# Altium schematic sheet FPGA_Power.SchDoc: {Наименование}
size 420 x 297 mm; DocumentNumber: ПЛАС.ХХХХХХ.ХХХ ХХ; SheetNumber: 3; SheetTotal: 11; PageSetup: Record=PageOptions|CenterHorizontal=False|CenterVertical=False|PrintScale=0.95|XCorrection=0.00|YCorrection=0.00|PrintKind=1|BorderSize=5000000|LeftOffset=0|BottomOffset=0|Orientation=1|PaperLength=1000|PaperWidth=1000|Scale=100|PaperSource=15|PrintQuality=600|MediaType=1|DitherType=10|PaperKind=A4|PrintScaleMode=1; Rule: PcbType=ProtelPcb
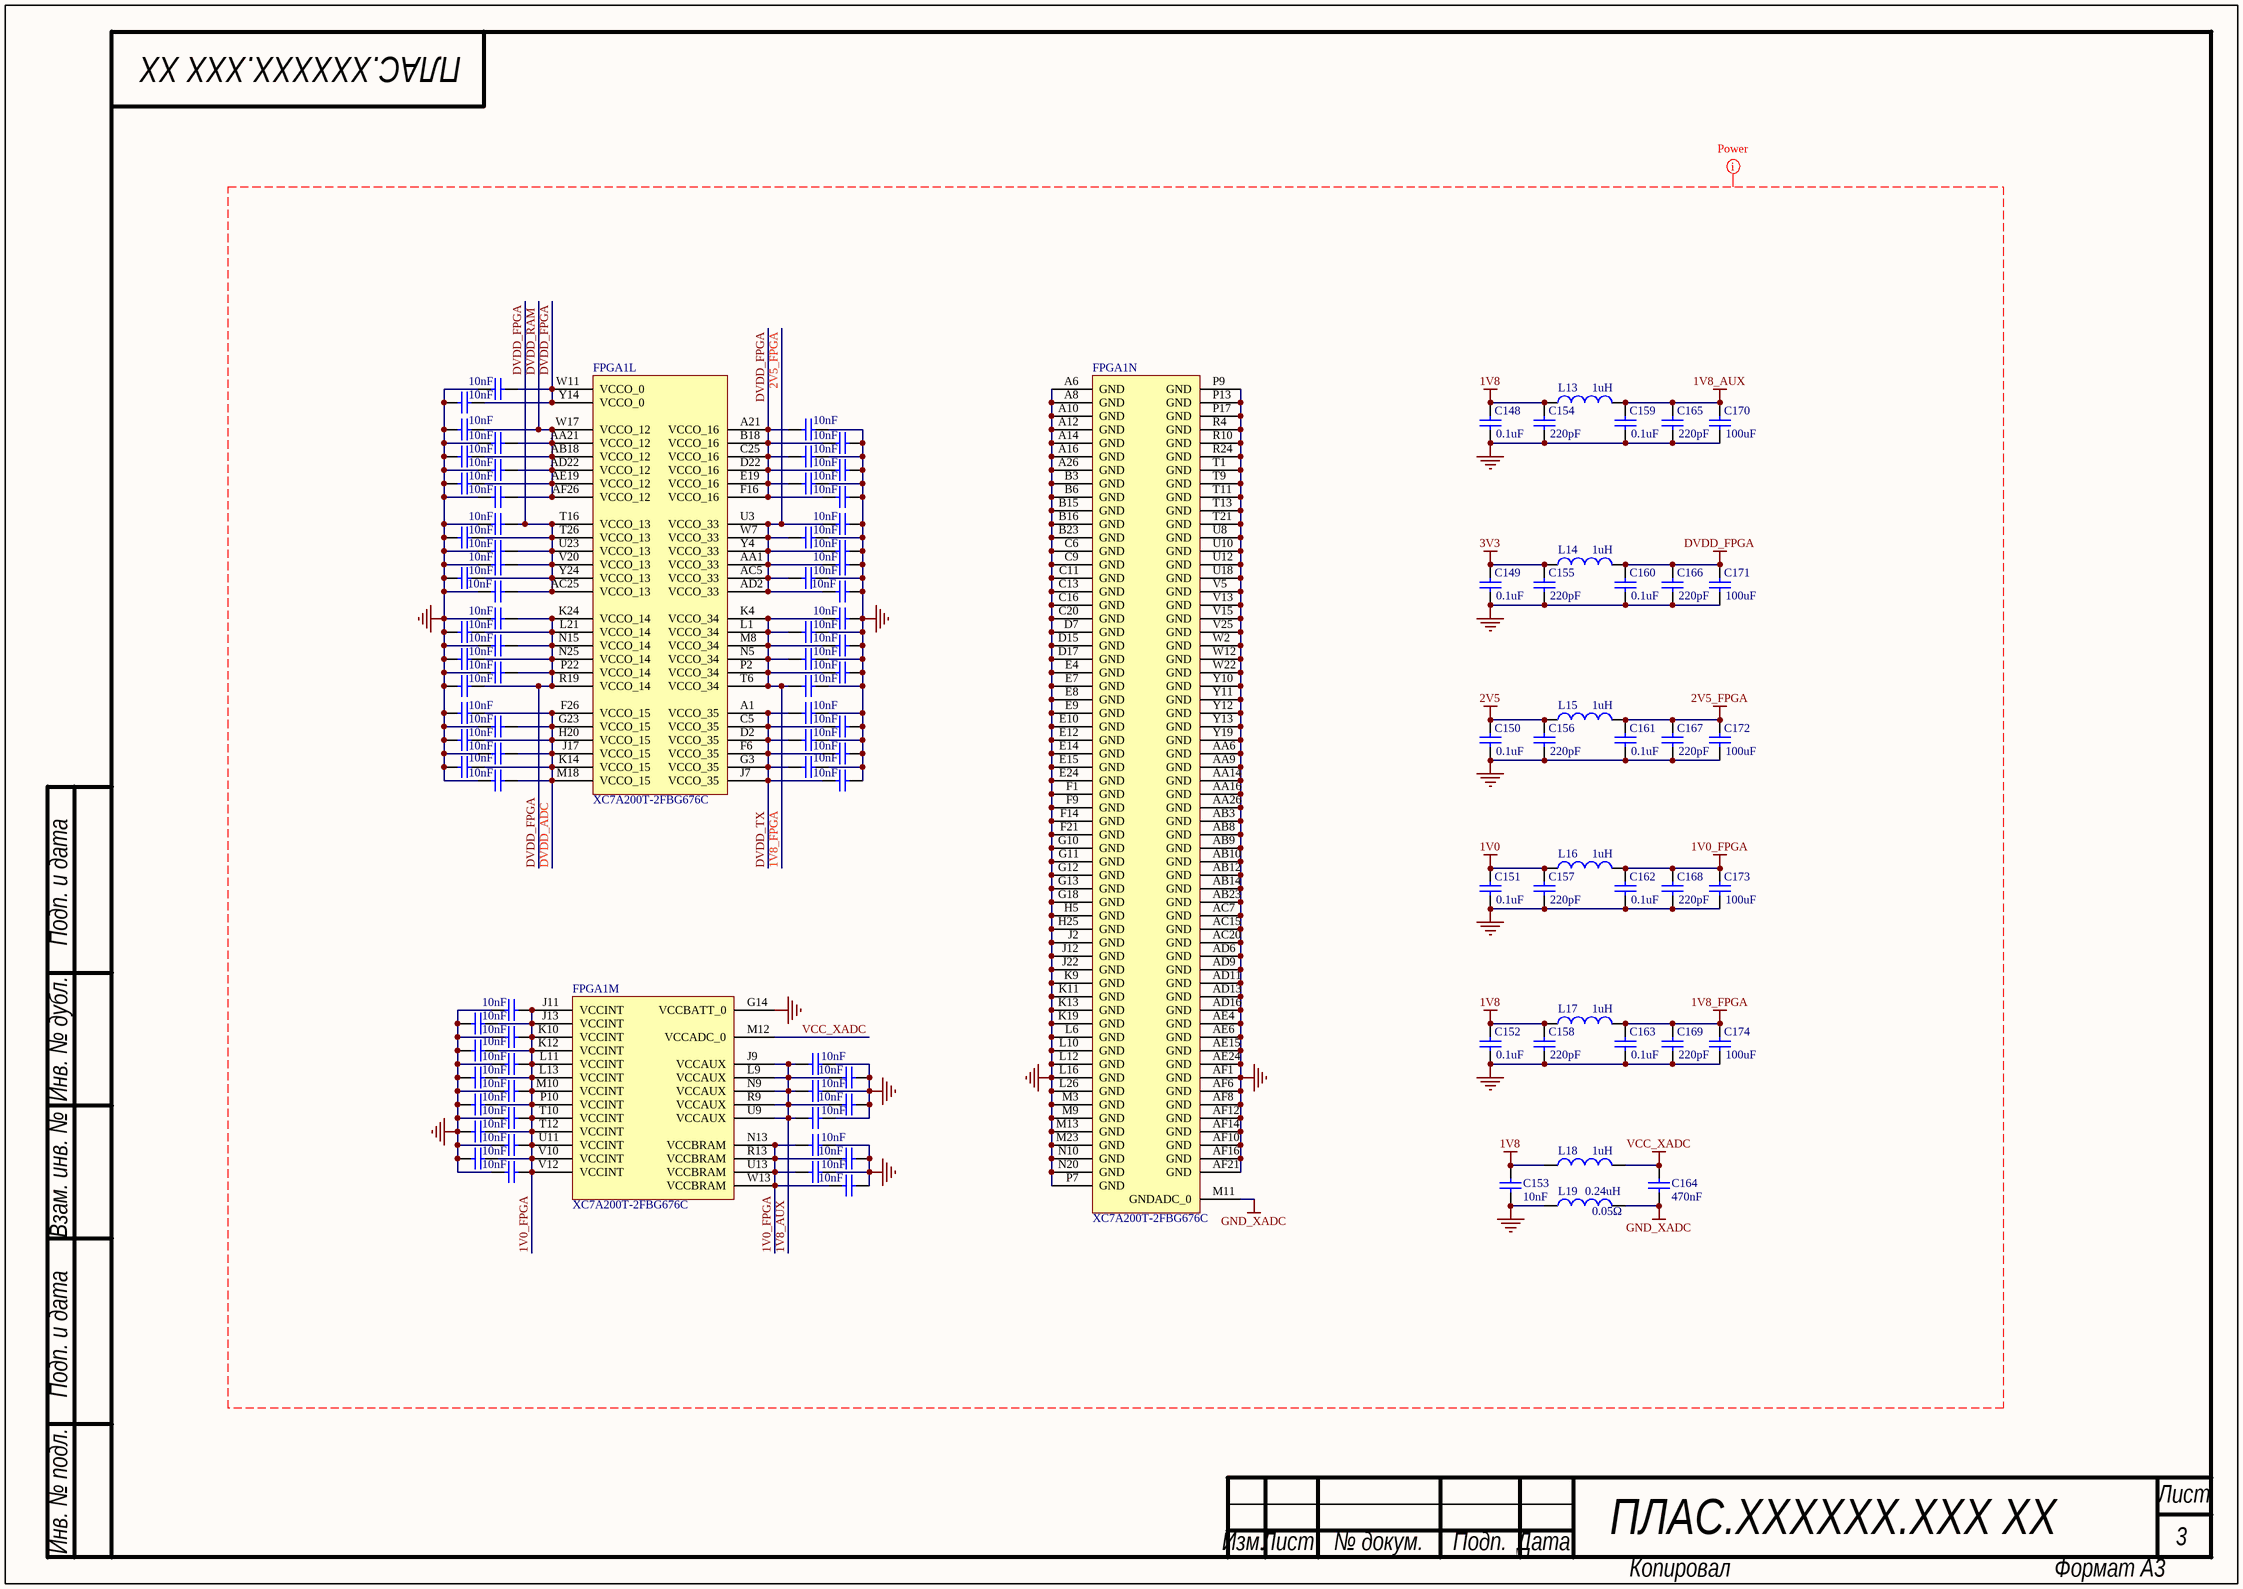
[diagram p0: FPGA_Power.SchDoc]

## Parts
C76  value 10nF  [С0402]  (hidden comment: Cap)
C77  value 10nF  [С0402]  (hidden comment: Cap)
C78  value 10nF  [С0402]  (hidden comment: Cap)
C79  value 10nF  [С0402]  (hidden comment: Cap)
C80  value 10nF  [С0402]  (hidden comment: Cap)
C81  value 10nF  [С0402]  (hidden comment: Cap)
C82  value 10nF  [С0402]  (hidden comment: Cap)
C83  value 10nF  [С0402]  (hidden comment: Cap)
C84  value 10nF  [С0402]  (hidden comment: Cap)
C85  value 10nF  [С0402]  (hidden comment: Cap)
C86  value 10nF  [С0402]  (hidden comment: Cap)
C87  value 10nF  [С0402]  (hidden comment: Cap)
C88  value 10nF  [С0402]  (hidden comment: Cap)
C89  value 10nF  [С0402]  (hidden comment: Cap)
C90  value 10nF  [С0402]  (hidden comment: Cap)
C91  value 10nF  [С0402]  (hidden comment: Cap)
C92  value 10nF  [С0402]  (hidden comment: Cap)
C93  value 10nF  [С0402]  (hidden comment: Cap)
C94  value 10nF  [С0402]  (hidden comment: Cap)
C95  value 10nF  [С0402]  (hidden comment: Cap)
C96  value 10nF  [С0402]  (hidden comment: Cap)
C97  value 10nF  [С0402]  (hidden comment: Cap)
C98  value 10nF  [С0402]  (hidden comment: Cap)
C99  value 10nF  [С0402]  (hidden comment: Cap)
C100  value 10nF  [С0402]  (hidden comment: Cap)
C101  value 10nF  [С0402]  (hidden comment: Cap)
C102  value 10nF  [С0402]  (hidden comment: Cap)
C103  value 10nF  [С0402]  (hidden comment: Cap)
C104  value 10nF  [С0402]  (hidden comment: Cap)
C105  value 10nF  [С0402]  (hidden comment: Cap)
C106  value 10nF  [С0402]  (hidden comment: Cap)
C107  value 10nF  [С0402]  (hidden comment: Cap)
C108  value 10nF  [С0402]  (hidden comment: Cap)
C109  value 10nF  [С0402]  (hidden comment: Cap)
C110  value 10nF  [С0402]  (hidden comment: Cap)
C111  value 10nF  [С0402]  (hidden comment: Cap)
C112  value 10nF  [С0402]  (hidden comment: Cap)
C113  value 10nF  [С0402]  (hidden comment: Cap)
C114  value 10nF  [С0402]  (hidden comment: Cap)
C115  value 10nF  [С0402]  (hidden comment: Cap)
C116  value 10nF  [С0402]  (hidden comment: Cap)
C117  value 10nF  [С0402]  (hidden comment: Cap)
C118  value 10nF  [С0402]  (hidden comment: Cap)
C119  value 10nF  [С0402]  (hidden comment: Cap)
C120  value 10nF  [С0402]  (hidden comment: Cap)
C121  value 10nF  [С0402]  (hidden comment: Cap)
C122  value 10nF  [С0402]  (hidden comment: Cap)
C123  value 10nF  [С0402]  (hidden comment: Cap)
C124  value 10nF  [С0402]  (hidden comment: Cap)
C125  value 10nF  [С0402]  (hidden comment: Cap)
C126  value 10nF  [С0402]  (hidden comment: Cap)
C127  value 10nF  [С0402]  (hidden comment: Cap)
C128  value 10nF  [С0402]  (hidden comment: Cap)
C129  value 10nF  [С0402]  (hidden comment: Cap)
C130  value 10nF  [С0402]  (hidden comment: Cap)
C131  value 10nF  [С0402]  (hidden comment: Cap)
C132  value 10nF  [С0402]  (hidden comment: Cap)
C133  value 10nF  [С0402]  (hidden comment: Cap)
C134  value 10nF  [С0402]  (hidden comment: Cap)
C135  value 10nF  [С0402]  (hidden comment: Cap)
C136  value 10nF  [С0402]  (hidden comment: Cap)
C137  value 10nF  [С0402]  (hidden comment: Cap)
C138  value 10nF  [С0402]  (hidden comment: Cap)
C139  value 10nF  [С0402]  (hidden comment: Cap)
C140  value 10nF  [С0402]  (hidden comment: Cap)
C141  value 10nF  [С0402]  (hidden comment: Cap)
C142  value 10nF  [С0402]  (hidden comment: Cap)
C143  value 10nF  [С0402]  (hidden comment: Cap)
C144  value 10nF  [С0402]  (hidden comment: Cap)
C145  value 10nF  [С0402]  (hidden comment: Cap)
C146  value 10nF  [С0402]  (hidden comment: Cap)
C147  value 10nF  [С0402]  (hidden comment: Cap)
C148  value 0.1uF  [C0603]  (hidden comment: Cap)
C149  value 0.1uF  [C0603]  (hidden comment: Cap)
C150  value 0.1uF  [C0603]  (hidden comment: Cap)
C151  value 0.1uF  [C0603]  (hidden comment: Cap)
C152  value 0.1uF  [C0603]  (hidden comment: Cap)
C153  value 10nF  [С0402]  (hidden comment: Cap)
C154  value 220pF  [C0603]  (hidden comment: Cap)
C155  value 220pF  [C0603]  (hidden comment: Cap)
C156  value 220pF  [C0603]  (hidden comment: Cap)
C157  value 220pF  [C0603]  (hidden comment: Cap)
C158  value 220pF  [C0603]  (hidden comment: Cap)
C159  value 0.1uF  [C0603]  (hidden comment: Cap)
C160  value 0.1uF  [C0603]  (hidden comment: Cap)
C161  value 0.1uF  [C0603]  (hidden comment: Cap)
C162  value 0.1uF  [C0603]  (hidden comment: Cap)
C163  value 0.1uF  [C0603]  (hidden comment: Cap)
C164  value 470nF  [C0603]  (hidden comment: Cap)
C165  value 220pF  [C0603]  (hidden comment: Cap)
C166  value 220pF  [C0603]  (hidden comment: Cap)
C167  value 220pF  [C0603]  (hidden comment: Cap)
C168  value 220pF  [C0603]  (hidden comment: Cap)
C169  value 220pF  [C0603]  (hidden comment: Cap)
C170  value 100uF  [C1210]  (hidden comment: Cap)
C171  value 100uF  [C1210]  (hidden comment: Cap)
C172  value 100uF  [C1210]  (hidden comment: Cap)
C173  value 100uF  [C1210]  (hidden comment: Cap)
C174  value 100uF  [C1210]  (hidden comment: Cap)
FPGA1  XC7A200T-2FBG676C  [FGG676]  (parts L,M,N of 14)
L13  value 1uH  [L1210_Murata LQH]  (hidden comment: Inductor_LF)
L14  value 1uH  [L1210_Murata LQH]  (hidden comment: Inductor_LF)
L15  value 1uH  [L1210_Murata LQH]  (hidden comment: Inductor_LF)
L16  value 1uH  [L1210_Murata LQH]  (hidden comment: Inductor_LF)
L17  value 1uH  [L1210_Murata LQH]  (hidden comment: Inductor_LF)
L18  value 1uH  [L1206_Murata]  (hidden comment: Inductor_LF)
L19  value 0.24uH  DCR: 0.05Ω  [L0805_Murata_LQG]  (hidden comment: Inductor_LF)

## Nets
1V0: C151.1 C157.1 L16.2
1V0_FPGA: C88.1 C89.1 C90.1 C91.1 C92.2 C93.1 C108.2 C109.2 C110.1 C111.2 C112.2 C113.1 C114.1 C129.1 C130.2 C146.2 C147.2 C162.1 C168.1 C173.2 FPGA1.J11(VCCINT) FPGA1.J13(VCCINT) FPGA1.K10(VCCINT) FPGA1.K12(VCCINT) FPGA1.L11(VCCINT) FPGA1.L13(VCCINT) FPGA1.M10(VCCINT) FPGA1.N13(VCCBRAM) FPGA1.P10(VCCINT) FPGA1.R13(VCCBRAM) FPGA1.T10(VCCINT) FPGA1.T12(VCCINT) FPGA1.U11(VCCINT) FPGA1.U13(VCCBRAM) FPGA1.V10(VCCINT) FPGA1.V12(VCCINT) FPGA1.W13(VCCBRAM) L16.1
1V8: C148.1 C152.2 C153.2 C154.1 C158.1 L13.2 L17.2 L18.2
1V8_AUX: C126.1 C127.1 C128.2 C144.1 C145.2 C159.1 C165.1 C170.2 FPGA1.J9(VCCAUX) FPGA1.L9(VCCAUX) FPGA1.N9(VCCAUX) FPGA1.R9(VCCAUX) FPGA1.U9(VCCAUX) L13.1
1V8_FPGA: C120.2 C121.2 C122.2 C138.2 C139.2 C140.2 C163.1 C169.1 C174.1 FPGA1.K4(VCCO_34) FPGA1.L1(VCCO_34) FPGA1.M8(VCCO_34) FPGA1.N5(VCCO_34) FPGA1.P2(VCCO_34) FPGA1.T6(VCCO_34) L17.1
2V5: C150.1 C156.1 L15.2
2V5_FPGA: C118.2 C119.2 C134.2 C135.2 C136.1 C137.2 C161.1 C167.1 C172.2 FPGA1.AA1(VCCO_33) FPGA1.AC5(VCCO_33) FPGA1.AD2(VCCO_33) FPGA1.U3(VCCO_33) FPGA1.W7(VCCO_33) FPGA1.Y4(VCCO_33) L15.1
3V3: C149.1 C155.1 L14.1
DVDD_FPGA: C76.2 C80.1 C81.1 C82.1 C83.1 C84.1 C94.2 C98.1 C99.2 C100.1 C101.1 C102.1 C103.1 C104.1 C115.2 C116.2 C117.2 C131.2 C132.2 C133.2 C160.1 C166.1 C171.1 FPGA1.A21(VCCO_16) FPGA1.AC25(VCCO_13) FPGA1.B18(VCCO_16) FPGA1.C25(VCCO_16) FPGA1.D22(VCCO_16) FPGA1.E19(VCCO_16) FPGA1.F16(VCCO_16) FPGA1.K24(VCCO_14) FPGA1.L21(VCCO_14) FPGA1.N15(VCCO_14) FPGA1.N25(VCCO_14) FPGA1.P22(VCCO_14) FPGA1.R19(VCCO_14) FPGA1.T16(VCCO_13) FPGA1.T26(VCCO_13) FPGA1.U23(VCCO_13) FPGA1.V20(VCCO_13) FPGA1.W11(VCCO_0) FPGA1.Y14(VCCO_0) FPGA1.Y24(VCCO_13) L14.2
GND: C76.1 C77.2 C78.2 C79.2 C80.2 C81.2 C82.2 C83.2 C84.2 C85.1 C86.1 C87.1 C88.2 C89.2 C90.2 C91.2 C92.1 C93.2 C94.1 C95.2 C96.2 C97.2 C98.2 C99.1 C100.2 C101.2 C102.2 C103.2 C104.2 C105.1 C106.1 C107.1 C108.1 C109.1 C110.2 C111.1 C112.1 C113.2 C114.2 C115.1 C116.1 C117.1 C118.1 C119.1 C120.1 C121.1 C122.1 C123.1 C124.1 C125.1 C126.2 C127.2 C128.1 C129.2 C130.1 C131.1 C132.1 C133.1 C134.1 C135.1 C136.2 C137.1 C138.1 C139.1 C140.1 C141.1 C142.1 C143.1 C144.2 C145.1 C146.1 C147.1 C148.2 C149.2 C150.2 C151.2 C152.1 C153.1 C154.2 C155.2 C156.2 C157.2 C158.2 C159.2 C160.2 C161.2 C162.2 C163.2 C165.2 C166.2 C167.2 C168.2 C169.2 C170.1 C171.2 C172.1 C173.1 C174.2 FPGA1.A6(GND) FPGA1.A8(GND) FPGA1.A10(GND) FPGA1.A12(GND) FPGA1.A14(GND) FPGA1.A16(GND) FPGA1.A26(GND) FPGA1.AA6(GND) FPGA1.AA9(GND) FPGA1.AA14(GND) FPGA1.AA16(GND) FPGA1.AA26(GND) FPGA1.AB3(GND) FPGA1.AB8(GND) FPGA1.AB9(GND) FPGA1.AB10(GND) FPGA1.AB12(GND) FPGA1.AB14(GND) FPGA1.AB23(GND) FPGA1.AC7(GND) FPGA1.AC15(GND) FPGA1.AC20(GND) FPGA1.AD6(GND) FPGA1.AD9(GND) FPGA1.AD11(GND) FPGA1.AD13(GND) FPGA1.AD16(GND) FPGA1.AE4(GND) FPGA1.AE6(GND) FPGA1.AE15(GND) FPGA1.AE24(GND) FPGA1.AF1(GND) FPGA1.AF6(GND) FPGA1.AF8(GND) FPGA1.AF10(GND) FPGA1.AF12(GND) FPGA1.AF14(GND) FPGA1.AF16(GND) FPGA1.AF21(GND) FPGA1.B3(GND) FPGA1.B6(GND) FPGA1.B15(GND) FPGA1.B16(GND) FPGA1.B23(GND) FPGA1.C6(GND) FPGA1.C9(GND) FPGA1.C11(GND) FPGA1.C13(GND) FPGA1.C16(GND) FPGA1.C20(GND) FPGA1.D7(GND) FPGA1.D15(GND) FPGA1.D17(GND) FPGA1.E4(GND) FPGA1.E7(GND) FPGA1.E8(GND) FPGA1.E9(GND) FPGA1.E10(GND) FPGA1.E12(GND) FPGA1.E14(GND) FPGA1.E15(GND) FPGA1.E24(GND) FPGA1.F1(GND) FPGA1.F9(GND) FPGA1.F14(GND) FPGA1.F21(GND) FPGA1.G10(GND) FPGA1.G11(GND) FPGA1.G12(GND) FPGA1.G13(GND) FPGA1.G14(VCCBATT_0) FPGA1.G18(GND) FPGA1.H5(GND) FPGA1.H25(GND) FPGA1.J2(GND) FPGA1.J12(GND) FPGA1.J22(GND) FPGA1.K9(GND) FPGA1.K11(GND) FPGA1.K13(GND) FPGA1.K19(GND) FPGA1.L6(GND) FPGA1.L10(GND) FPGA1.L12(GND) FPGA1.L16(GND) FPGA1.L26(GND) FPGA1.M3(GND) FPGA1.M9(GND) FPGA1.M13(GND) FPGA1.M23(GND) FPGA1.N10(GND) FPGA1.N20(GND) FPGA1.P7(GND) FPGA1.P9(GND) FPGA1.P13(GND) FPGA1.P17(GND) FPGA1.R4(GND) FPGA1.R10(GND) FPGA1.R24(GND) FPGA1.T1(GND) FPGA1.T9(GND) FPGA1.T11(GND) FPGA1.T13(GND) FPGA1.T21(GND) FPGA1.U8(GND) FPGA1.U10(GND) FPGA1.U12(GND) FPGA1.U18(GND) FPGA1.V5(GND) FPGA1.V13(GND) FPGA1.V15(GND) FPGA1.V25(GND) FPGA1.W2(GND) FPGA1.W12(GND) FPGA1.W22(GND) FPGA1.Y10(GND) FPGA1.Y11(GND) FPGA1.Y12(GND) FPGA1.Y13(GND) FPGA1.Y19(GND) L19.1
GND_XADC: C164.2 FPGA1.M11(GNDADC_0) L19.2
VCC_XADC: C164.1 FPGA1.M12(VCCADC_0) L18.1
DVDD_ADC: C85.2 C86.2 C87.2 C105.2 C106.2 C107.2 FPGA1.F26(VCCO_15) FPGA1.G23(VCCO_15) FPGA1.H20(VCCO_15) FPGA1.J17(VCCO_15) FPGA1.K14(VCCO_15) FPGA1.M18(VCCO_15)
DVDD_RAM: C77.1 C78.1 C79.1 C95.1 C96.1 C97.1 FPGA1.AA21(VCCO_12) FPGA1.AB18(VCCO_12) FPGA1.AD22(VCCO_12) FPGA1.AE19(VCCO_12) FPGA1.AF26(VCCO_12) FPGA1.W17(VCCO_12)
DVDD_TX: C123.2 C124.2 C125.2 C141.2 C142.2 C143.2 FPGA1.A1(VCCO_35) FPGA1.C5(VCCO_35) FPGA1.D2(VCCO_35) FPGA1.F6(VCCO_35) FPGA1.G3(VCCO_35) FPGA1.J7(VCCO_35)

## Layout directives
net class Power: 1V0, 1V0_FPGA, 1V8, 1V8_AUX, 1V8_FPGA, 2V5, 2V5_FPGA, 3V3, DVDD_ADC, DVDD_FPGA, DVDD_RAM, DVDD_TX, GND, GND_XADC, VCC_XADC

## Notes on the sheet
- Подп. и дата
- Инв. № дубл.
- Взам. инв. №
- Инв. № подл.
- Лист
- Изм.
- № докум.
- Подп.
- Дата
- Копировал
- Формат А3

## Library data of the parts
C76-C147 C153 = Cer Cap: Cer Cap Small; Manufacturer: Murata; Material: x7r; Voltage: 25V; Tolerance: 10%; Type: Ceramic; PackageReference: SMD Chip Capacitor; Package: 0402
C148-C152 C154-C163 C165-C169 = Cer Cap: Cer Cap Small; Manufacturer: Murata; Material: x5r; Voltage: 16V; Tolerance: 10%; Type: Ceramic; PackageReference: SMD Chip Capacitor; Package: 0603
C164 = Cer Cap: Cer Cap Small; Manufacturer: Murata; Material: x7r; Voltage: 16V; Tolerance: 10%; Type: Ceramic; PackageReference: SMD Chip Capacitor; Package: 0603
C170-C174 = Cap uF: Cer Cap Large; Manufacturer: Murata; Material: x5r; Tolerance: 20%; Voltage: 6.3V; Type: Ceramic; Package: C1210; PackageDescription: SMD Chip Capacitor
FPGA1 = XC7A200T-2FBG676C: Artix-7 FPGA, 400 User I/Os, 8 GTP, 676-Ball BGA, Speed Grade 2, Commercial Grade, Pb-Free; Manufacturer: Xilinx; Block RAM Blocks (18Kb): 730; Block RAM Blocks (36Kb): 365; Block RAM Blocks (Max Kb): 13140; CLBs (Slices): 33650; Clock Mgmt Tiles (CMTs): 10; DSP48E1 Slices: 740; Logic Cells: 215360; Max User I/O: 500; Speed Grade: -2; DatasheetVersion: v1.12; PackageVersion: Rev 1.8; PackageReference: FBG676; PackageDescription: Flip-Chip Lidless BGA, Body 27 x 27 mm, 1.0 mm Pitch; Supplier 1: Digi-Key; Supplier Part Number 1: 122-1865-ND; CLBs (Max Distributed RAM Kb): 2888; Generic Part Number: XC7A200T; RoHS: Pb-Free; NexusDeviceID: XC7A200T-2FBG676C; Mounting Technology: Surface Mount; Code_JEDEC: MS-034; PartNumber: XC7A200T-2FBG676C; ComponentLink1Description: Manufacturer URL; ComponentLink1URL: http://www.xilinx.com/; ComponentLink2Description: Datasheet; ComponentLink2URL: http://www.xilinx.com/support/documentation/data_sheets/ds180_7Series_Overview.pdf; ComponentLink3Description: Package Specification; ComponentLink3URL: http://www.xilinx.com/support/documentation/user_guides/ug475_7Series_Pkg_Pinout.pdf; ComponentLink4Description: DC and Switching Characteristics; ComponentLink4URL: http://www.xilinx.com/support/documentation/data_sheets/ds181_Artix_7_Data_Sheet.pdf; ComponentLink5Description: Package File; ComponentLink5URL: http://www.xilinx.com/support/packagefiles/a7packages/xc7a200tfbg676pkg.txt; ComponentLink6Description: Packaging and Pinout; ComponentLink6URL: http://www.xilinx.com/support/documentation/user_guides/ug475_7Series_Pkg_Pinout.pdf
L13-L17 = Inductor_LF: Inductor_Power_Lines; Manufacturer: Murata; Name: LQH32PN1R0NNC; Tolerance: 5%; Current: 2500mA; Frequency: 100MHz; Package: 1210; PackageDescription: Chip Inductor; Temperature Range: -25…85; Series: LQH
L18 = Inductor_LF: Inductor_Power_Lines; Manufacturer: Murata; Name: LQM31PN1R0M00; Tolerance: 5%; Current: 1200mA; Frequency: 60MHz; Package: 1206; PackageDescription: Chip Inductor; Temperature Range: -25…85; Series: LQM
L19 = Inductor_LF: Inductor_Power_Lines; Manufacturer: Murata; Name: LQM21PNR24MEH; Tolerance: ±20%; Current: 2.4A; Frequency: 130MHz; Package: 0805; PackageDescription: Chip Inductor; Temperature Range: -25…85; Series: LQM